# EasyEDA schematic 1-Schematic_OrionPRO-Original.json, sheets 3 to 6 of 6

## Sheets
3 System-BUS: TITLE: OrionPRO - Системная шина; Date: 2021-10-26; Sheet: 3/6
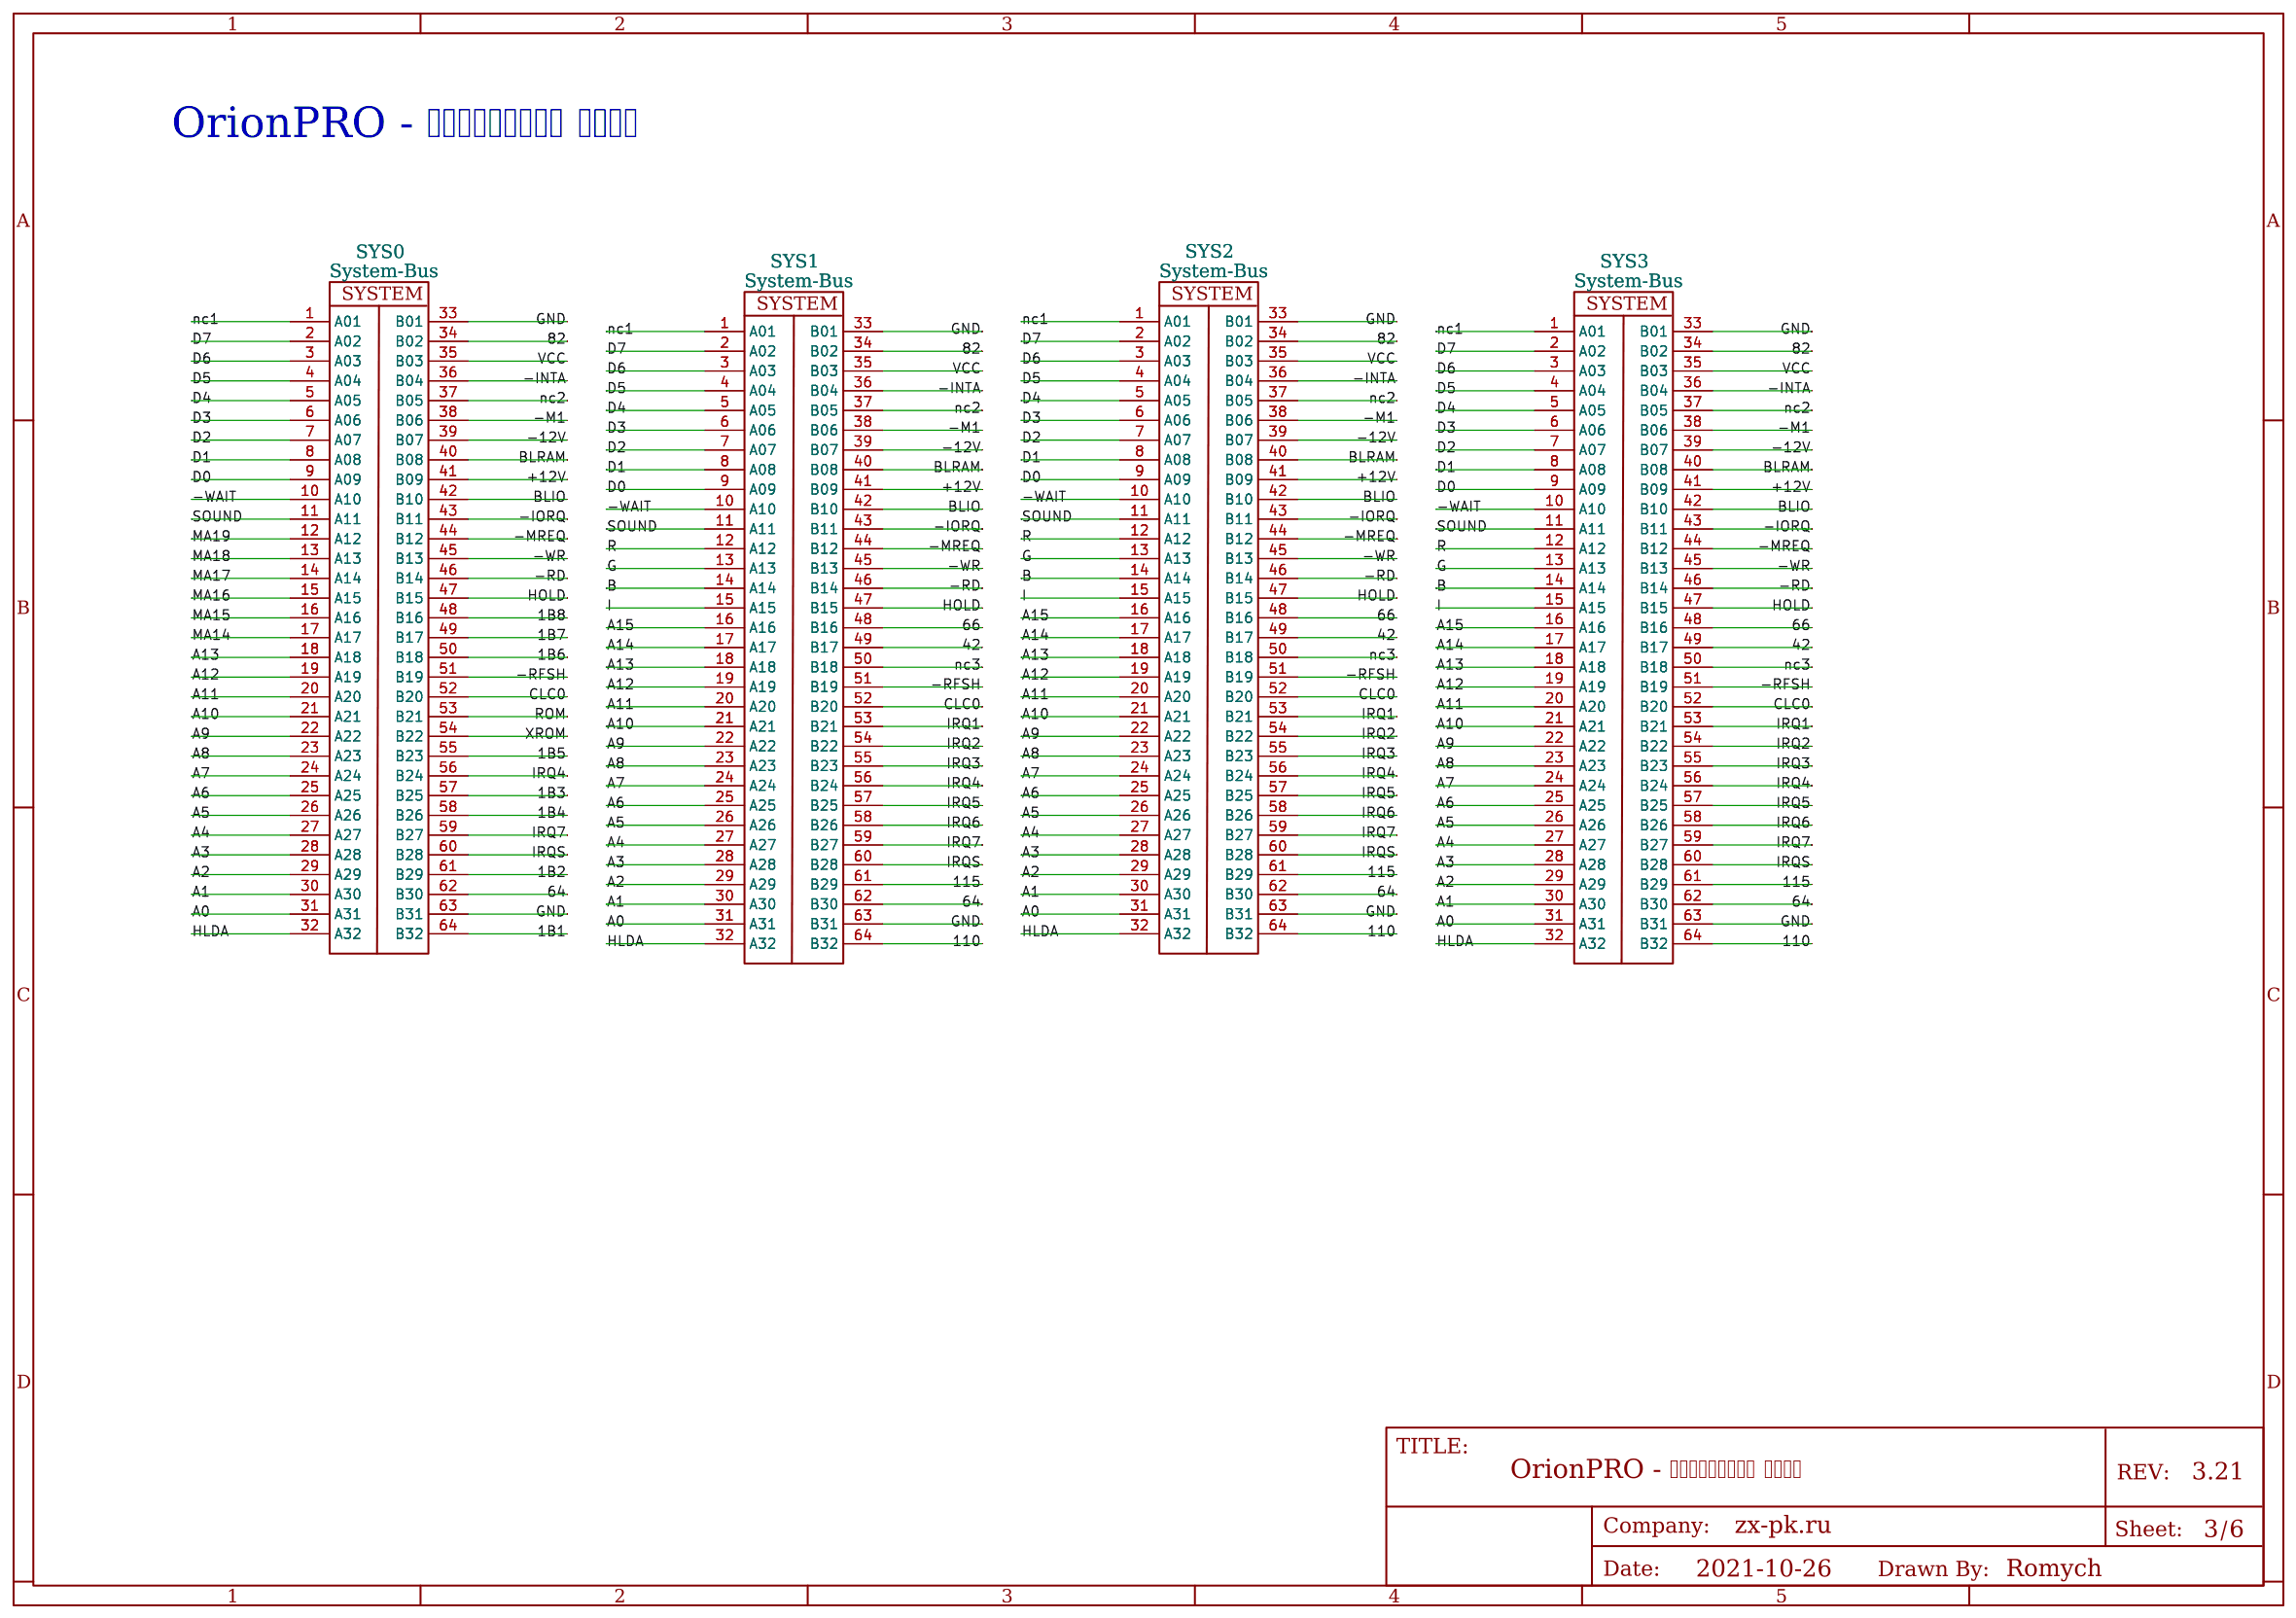
[diagram p2: System-BUS]
4 PowerSource: TITLE: Orion-PRO AT- Питание; Date: 2021-10-31; Sheet: 4/6
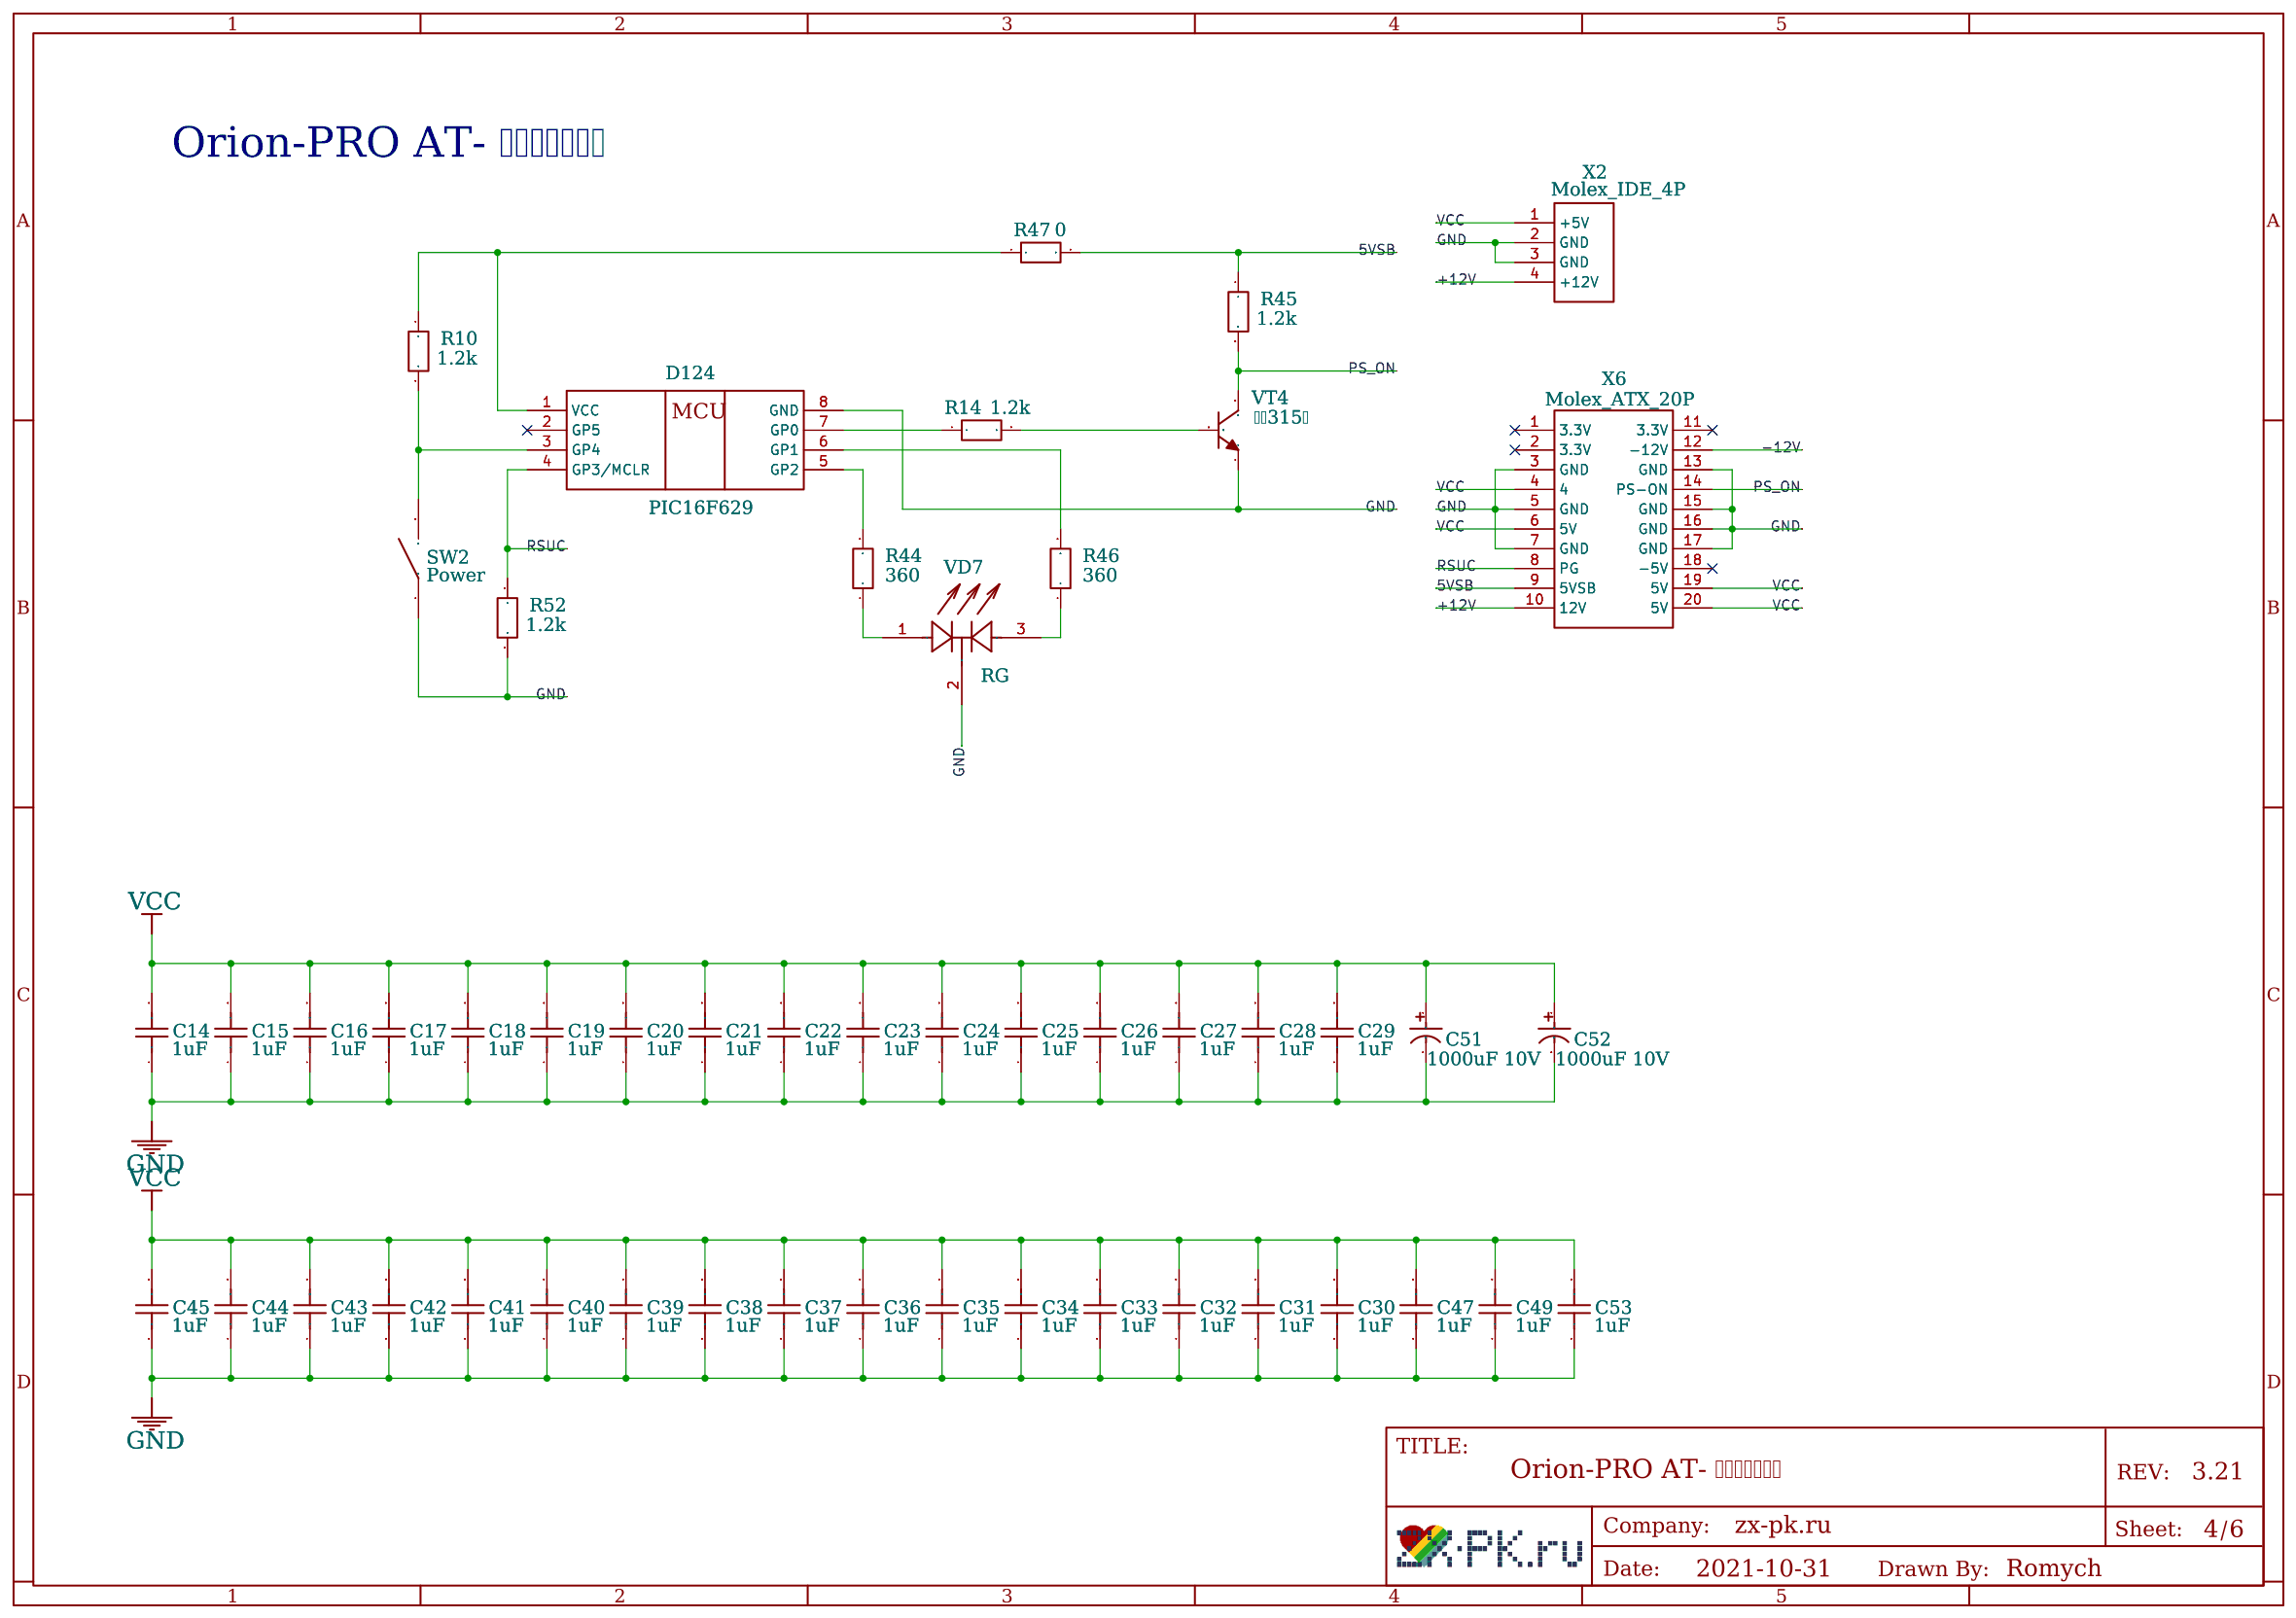
[diagram p3: PowerSource]
5 PS2Controller: TITLE: OrionPRO - Контроллер клавиатуры PS/2; Date: 2021-11-02; Sheet: 5/6
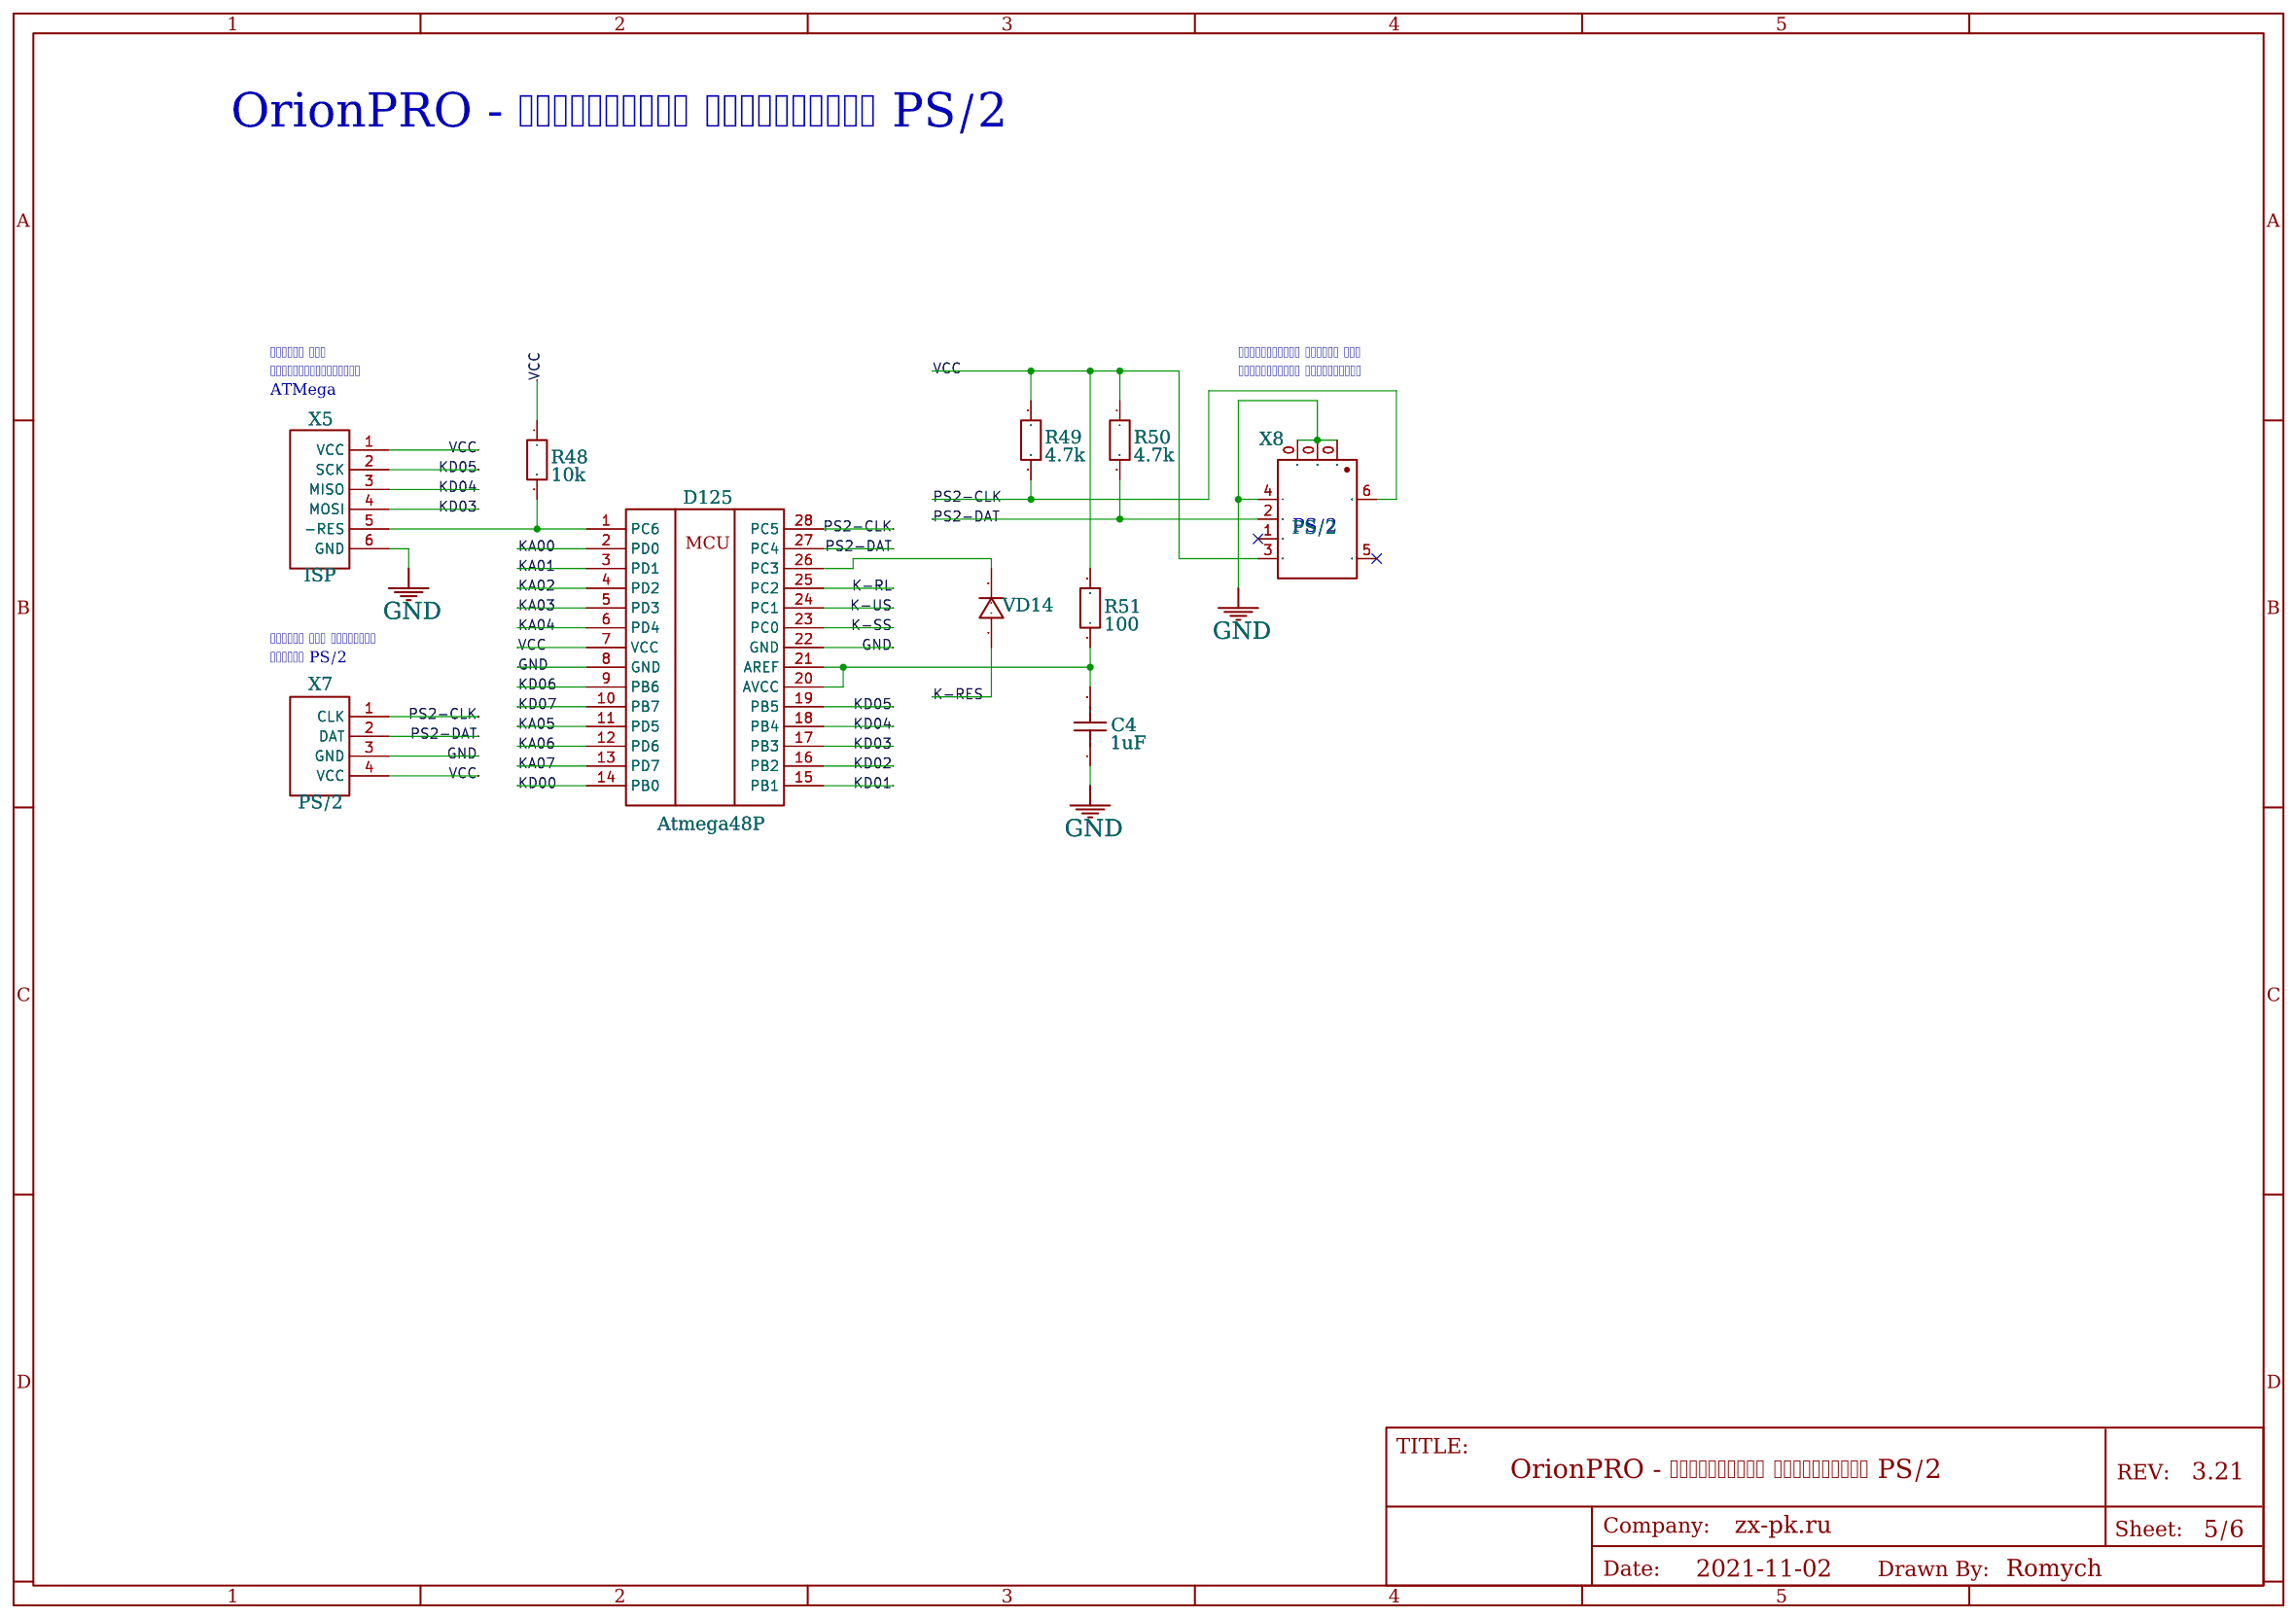
[diagram p4: PS2Controller]
6 Error404: TITLE: OrionPRO - Доработки от error404; Date: 2021-11-06; Sheet: 6/6
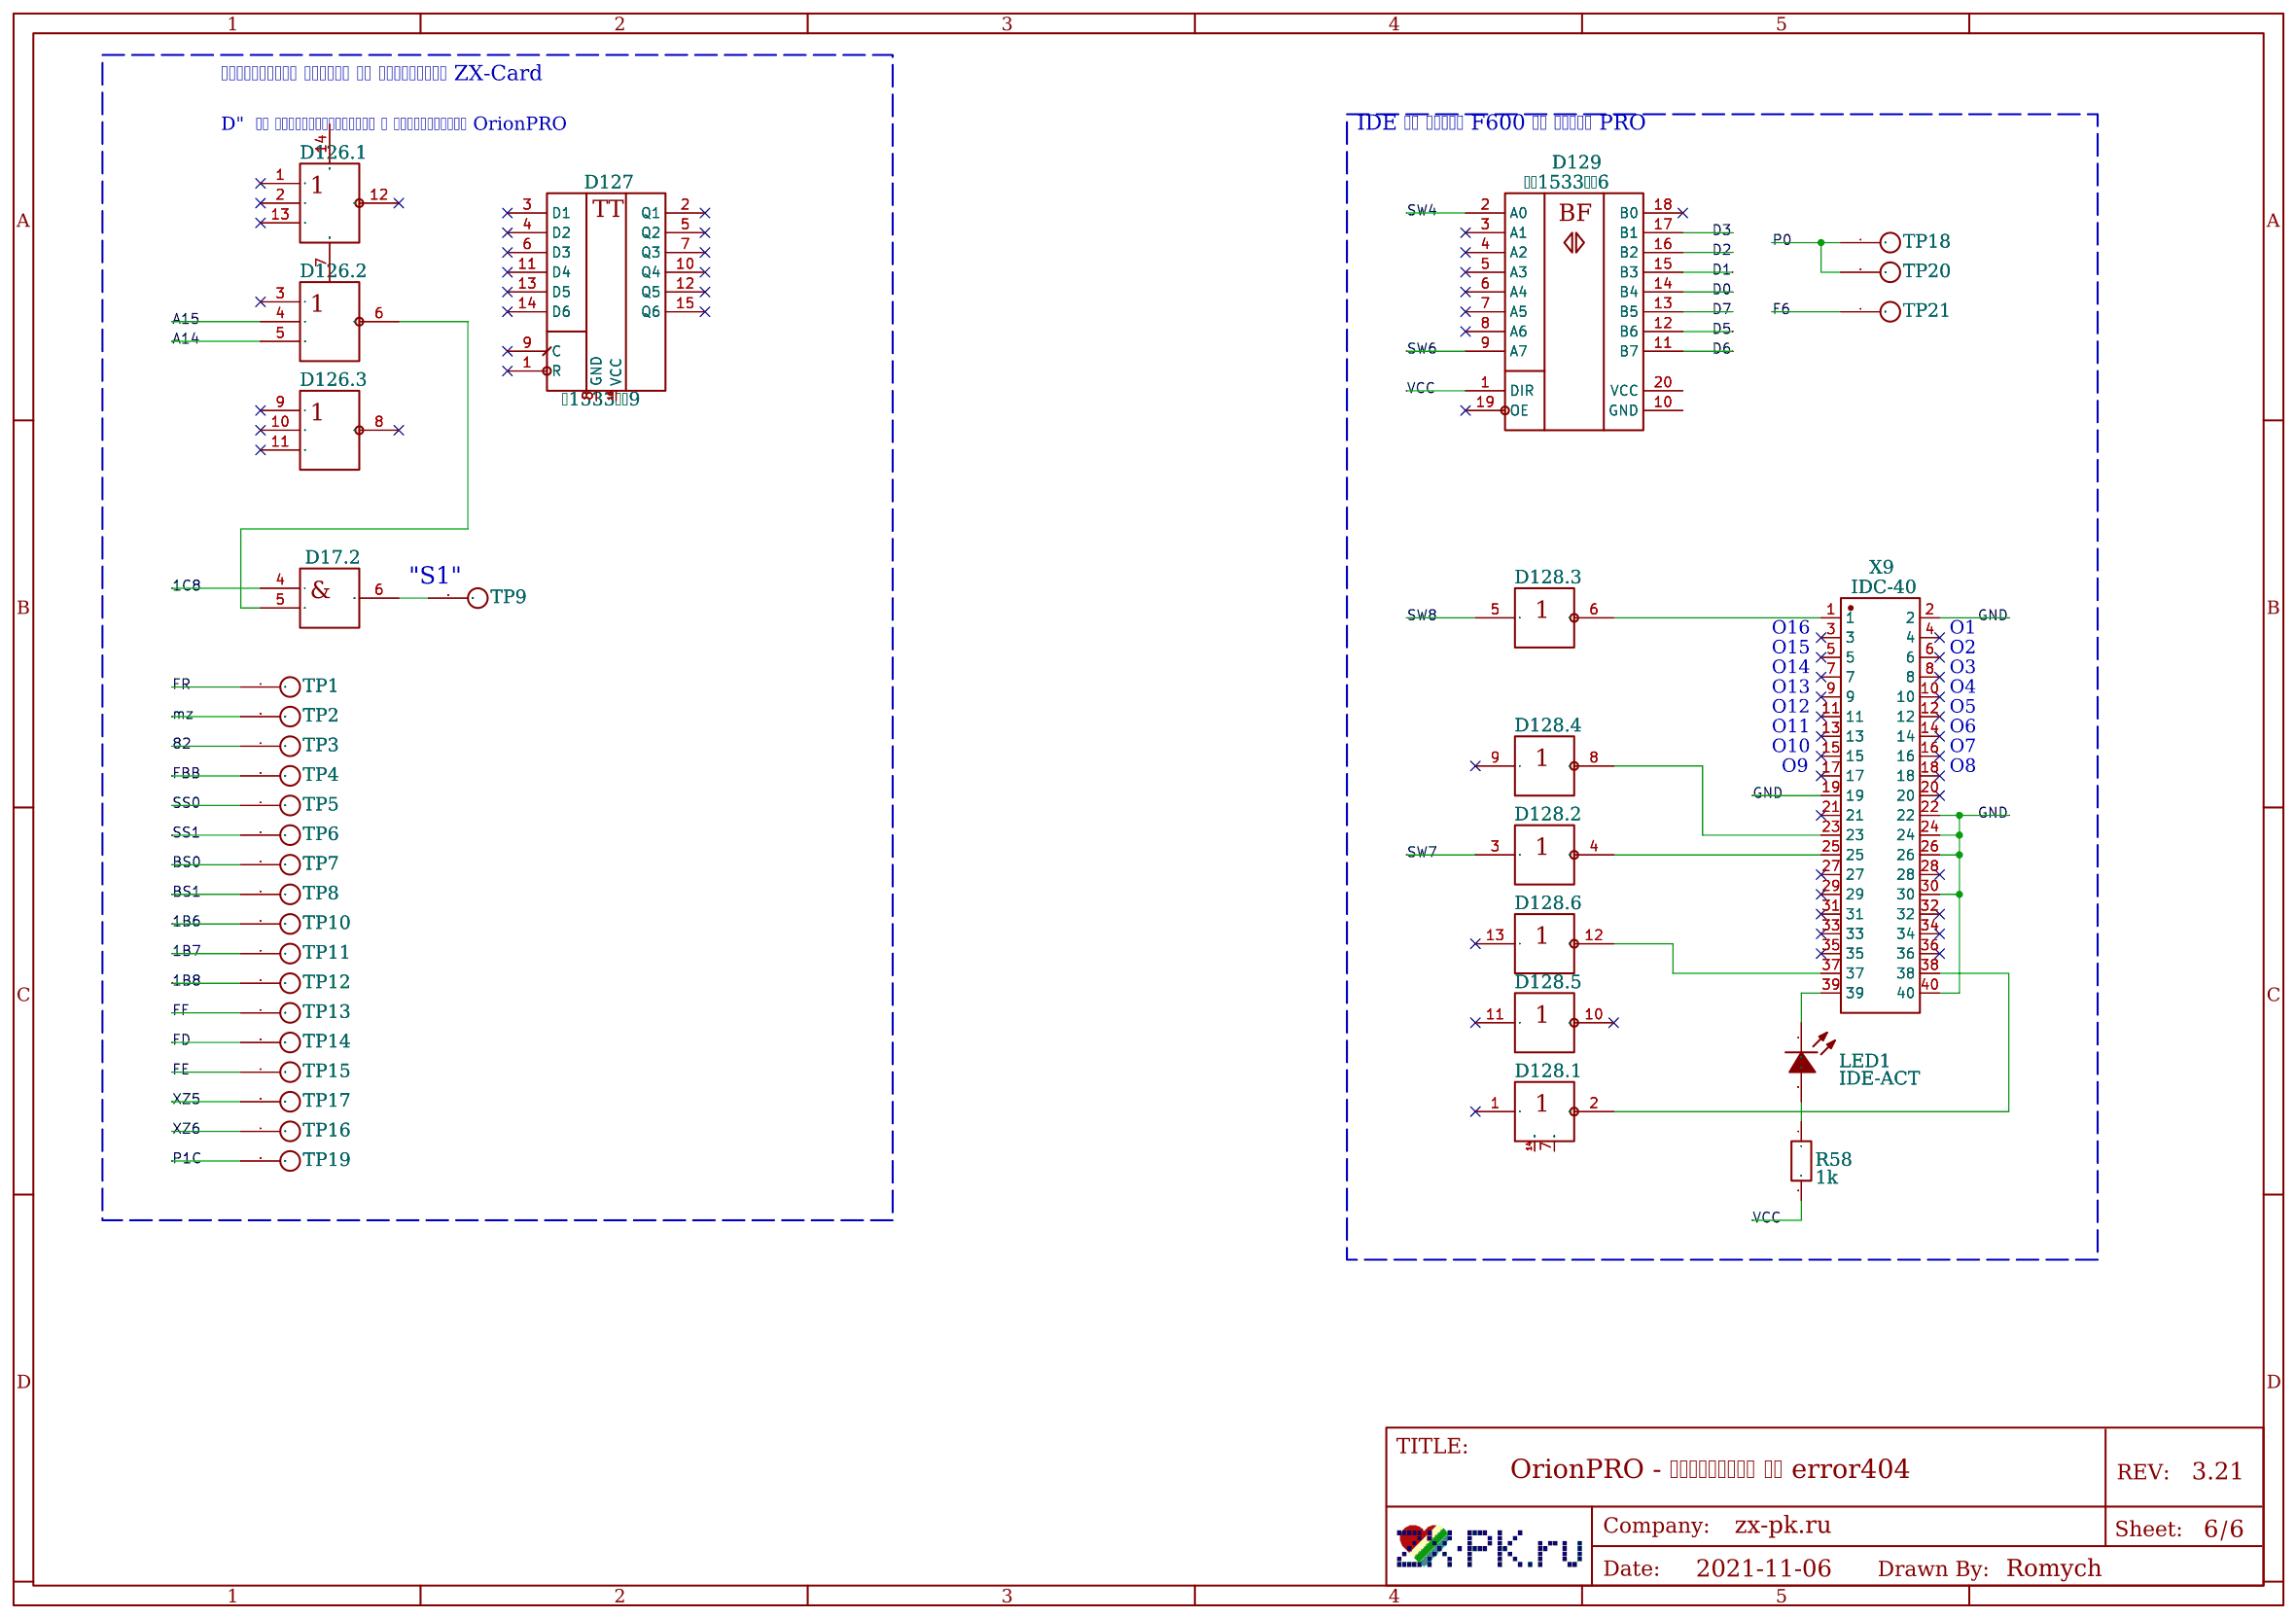
[diagram p5: Error404]

## Parts
sheet Error404
D127  К1533ТМ9  [DIP-16_STD]
D129  КР1533АП6  [DIP-20_STD]
LED1  IDE-ACT  [LED-TH_BD3.0-P2.54-FD]
R58  1k  [R_0.125_V_TH]
TP1  FR  [TH-TEST-1]
TP2  mz  [TH-TEST-1]
TP3  -RES  [TH-TEST-1]
TP4  FB  [SMD-TEST-1-SMALL]
TP5  SS0  [SMD-TEST-1-SMALL]
TP6  SS1  [SMD-TEST-1-SMALL]
TP7  BS0  [SMD-TEST-1-SMALL]
TP8  BS1  [SMD-TEST-1-SMALL]
TP9  S1  [TH-TEST-1]
TP10  1B6  [TH-TEST-1]
TP11  1B7  [TH-TEST-1]
TP12  1B8  [TH-TEST-1]
TP13  ff  [TH-TEST-1]
TP14  fd  [TH-TEST-1]
TP15  fe  [TH-TEST-1]
TP16  xz6  [TH-TEST-1]
TP17  xz5  [TH-TEST-1]
TP18  prn  [TH-TEST-1]
TP19  P1C  [TH-TEST-1]
TP20  P0  [TH-TEST-1]
TP21  F600  [TH-TEST-1]
X9  IDC-40  [CONN-TH_40P-P2.54_MTFD10-40B1]
sheet PowerSource
C14  1uF  [CAP-TH_L7.62]
C15  1uF  [CAP-TH_L7.62]
C16  1uF  [CAP-TH_L7.62]
C17  1uF  [CAP-TH_L7.62]
C18  1uF  [CAP-TH_L7.62]
C19  1uF  [CAP-TH_L7.62]
C20  1uF  [CAP-TH_L7.62]
C21  1uF  [CAP-TH_L7.62]
C22  1uF  [CAP-TH_L7.62]
C23  1uF  [CAP-TH_L7.62]
C24  1uF  [CAP-TH_L7.62]
C25  1uF  [CAP-TH_L7.62]
C26  1uF  [CAP-TH_L7.62]
C27  1uF  [CAP-TH_L7.62]
C28  1uF  [CAP-TH_L7.62]
C29  1uF  [CAP-TH_L7.62]
C30  1uF  [CAP-TH_L7.62]
C31  1uF  [CAP-TH_L7.62]
C32  1uF  [CAP-TH_L7.62]
C33  1uF  [CAP-TH_L7.62]
C34  1uF  [CAP-TH_L7.62]
C35  1uF  [CAP-TH_L7.62]
C36  1uF  [CAP-TH_L7.62]
C37  1uF  [CAP-TH_L7.62]
C38  1uF  [CAP-TH_L7.62]
C39  1uF  [CAP-TH_L7.62]
C40  1uF  [CAP-TH_L7.62]
C41  1uF  [CAP-TH_L7.62]
C42  1uF  [CAP-TH_L7.62]
C43  1uF  [CAP-TH_L7.62]
C44  1uF  [CAP-TH_L7.62]
C45  1uF  [CAP-TH_L5.08]
C47  1uF  [CAP-TH_L7.62]
C49  1uF  [CAP-TH_L7.62]
C51  1000uF 10V  [CAP-TH_L25_P7.62_EL_V]
C52  1000uF 10V  [CAP-TH_L25_P7.62_EL_H]
C53  1uF  [CAP-TH_L7.62]
D124  PIC16F629  [DIP-8_STD]
R10  1.2k  [R_0.125_V_TH]
R14  1.2k  [R_0.125_V_TH]
R44  360  [R_0.125_V_TH]
R45  1.2k  [R_0.125_V_TH]
R46  360  [R_0.125_V_TH]
R47  0  [R_0.125_V_TH]
R52  1.2k  [R_0.125_V_TH]
SW2  Power  [HDR-TH_2P_P2.54_SW]
VD7  RG  [LED_BICOL_AKA_5]
VT4  КТ315Б  [TO-92-3_L4.8-W3.7-P2.54-L]
X2  Molex_IDE_4P  [HDR-TH_4P_5.08_MOLEX]
X6  Molex_ATX_20P  [CONN-TH_20P-P4.20_5566-20A]
sheet PS2Controller
C4  1uF  [CAP-TH_L5.08]
D125  Atmega48P  [DIP-28_L35.0-W6.5-P2.54-LS7.6-BL]
R48  10k  [R_0.125_7.62]
R49  4.7k  [R_0.25_10.16]
R50  4.7k  [R_0.25_10.16]
R51  100  [R_0.125_V_TH]
VD14  1N4148  [D_TH_7.62]
X5  ISP  [HDR-TH_6P-P2.54]
X7  PS/2  [HDR-TH_4P-P2.54]
X8  PS/2  [PS2-TH_6P-P2.05-S2.49_L12.8-W14.0-M]
sheet System-BUS
SYS0  System-Bus  [SYS_CONN_OPRO_32X2_MB]
SYS1  System-Bus  [SYS_CONN_OPRO_32X2_MB]
SYS2  System-Bus  [SYS_CONN_OPRO_32X2_MB]
SYS3  System-Bus  [SYS_CONN_OPRO_32X2_MB]

## Library data of the parts
D127 = К1533ТМ9: Supplier: chipdip; Contributor: Roman Boykov
D129 = КР1533АП6: Supplier: chipdip; Contributor: romychs_4693
LED1 = HL-304H3GD: Supplier: LCSC; Supplier Part: C568935; Manufacturer: HONGLITRONIC(Hongli Zhihui (HONGLITRONIC)); Contributor: LCSC
R10 R14 R44-R52 R58 = RN 1/8W 470R F T/B A1: Supplier: LCSC; Supplier Part: C433478; Manufacturer: TyoHM; Contributor: LCSC
TP1-TP3 TP9-TP21 = TH-TEST-1: Contributor: romychs_4693
TP4-TP8 = SMD-TEST-1-RND: Contributor: Roman Boykov
X9 = MTFD10-40B1: Supplier: LCSC; Supplier Part: C376159; Manufacturer: MINTRON; Contributor: LCSC
C14-C45 C47 C49 C53 = CK45-R3AD152K-VRY: Supplier: LCSC; Supplier Part: C340608; Manufacturer: TDK; Contributor: LCSC; JLCPCB Part Class: Extended Part
C51 C52 = ECLJ0612220M101P00: Supplier: LCSC; Supplier Part: C156809; Manufacturer: Guangdong TOPAZ Elec Tech; Contributor: LCSC
D124 = PIC16F629: Manufacturer: Microchip; Contributor: romychs_4693
SW2 = Switch-2.5mm: Contributor: romychs_4693
VD7 = BiColorLED-AKA: Contributor: Roman Boykov
VT4 = 2SC1815-TA: Supplier: LCSC; Manufacturer: CJ; image: //image.lceda.cn/szlcsc/C41114.jpg; Supplier Part: C41114
X2 = Molex_IDE_4P: Contributor: romychs_4693
X6 = Molex_ATX_20P: Contributor: Roman Boykov
C4 = CK45-R3AD152K-VRY: Supplier: LCSC; Supplier Part: C340608; Manufacturer: TDK; Contributor: LCSC
D125 = Atmega48P: Manufacturer Part: Atmel; Contributor: Roman Boykov
VD14 = 1N4148: Contributor: EasyEDA
X5 = Atmega-ISP-6P: Contributor: romychs_4693
X7 = PinHeader_1x4: Contributor: Roman Boykov
X8 = 5749180-1: Supplier: LCSC; Supplier Part: C305986; Manufacturer: TE Connectivity; Contributor: LCSC
SYS0-SYS3 = SysConnOPro-32MB: Supplier: chipdip; Contributor: Roman Boykov

## Nets
5VSB: R45.1 R47.2 X6.9(5VSB)
+12V: SYS0.41(B09) SYS1.41(B09) SYS2.41(B09) SYS3.41(B09) X2.4(+12V) X6.10(12V) ; also on sheet 1
-12V: SYS0.39(B07) SYS1.39(B07) SYS2.39(B07) SYS3.39(B07) X6.12(-12V)
GND: C4.1 C14.1 C15.1 C16.1 C17.1 C18.1 C19.1 C20.1 C21.1 C22.1 C23.1 C24.1 C25.1 C26.1 C27.1 C28.1 C29.1 C30.1 C31.1 C32.1 C33.1 C34.1 C35.1 C36.1 C37.1 C38.1 C39.1 C40.1 C41.1 C42.1 C43.1 C44.1 C45.1 C47.1 C49.1 C51.2 C52.2 C53.1 D124.8(GND) D125.8(GND) D125.22(GND) R52.2 SW2.1 SYS0.33(B01) SYS0.63(B31) SYS1.33(B01) SYS1.63(B31) SYS2.33(B01) SYS2.63(B31) SYS3.33(B01) SYS3.63(B31) VD7.2 VT4.1(E) X2.2(GND) X2.3(GND) X5.6(GND) X6.3(GND) X6.5(GND) X6.7(GND) X6.13(GND) X6.15(GND) X6.16(GND) X6.17(GND) X7.3(GND) X8.0 X8.4 X9.2 X9.19 X9.22 X9.24 X9.26 X9.30 X9.40 ; also on sheet 1
VCC: C14.2 C15.2 C16.2 C17.2 C18.2 C19.2 C20.2 C21.2 C22.2 C23.2 C24.2 C25.2 C26.2 C27.2 C28.2 C29.2 C30.2 C31.2 C32.2 C33.2 C34.2 C35.2 C36.2 C37.2 C38.2 C39.2 C40.2 C41.2 C42.2 C43.2 C44.2 C45.2 C47.2 C49.2 C51.1 C52.1 C53.2 D125.7(VCC) D129.1(DIR) R48.1 R49.1 R50.1 R51.2 R58.2 SYS0.35(B03) SYS1.35(B03) SYS2.35(B03) SYS3.35(B03) X2.1(+5V) X5.1(VCC) X6.4 X6.6(5V) X6.19(5V) X6.20(5V) X7.4(VCC) X8.3 ; also on sheet 1
1B1: SYS0.64(B32) ; also on sheet 1
1B2: SYS0.61(B29) ; also on sheet 1
1B3: SYS0.57(B25) ; also on sheet 1
1B4: SYS0.58(B26) ; also on sheet 1
1B5: SYS0.55(B23) ; also on sheet 1
1B6: SYS0.50(B18) TP10.1(TP1) ; also on sheet 1
1B7: SYS0.49(B17) TP11.1(TP1) ; also on sheet 1
1B8: SYS0.48(B16) TP12.1(TP1) ; also on sheet 1
42: SYS1.49(B17) SYS2.49(B17) SYS3.49(B17) ; also on sheet 1
64: SYS0.62(B30) SYS1.62(B30) SYS2.62(B30) SYS3.62(B30) ; also on sheet 1
66: SYS1.48(B16) SYS2.48(B16) SYS3.48(B16)
82: SYS0.34(B02) SYS1.34(B02) SYS2.34(B02) SYS3.34(B02) TP3.1(TP1) ; also on sheet 1
110: SYS1.64(B32) SYS2.64(B32) SYS3.64(B32) ; also on sheet 1
115: SYS1.61(B29) SYS2.61(B29) SYS3.61(B29) ; also on sheet 1
-INTA: SYS0.36(B04) SYS1.36(B04) SYS2.36(B04) SYS3.36(B04) ; also on sheet 1
-IORQ: SYS0.43(B11) SYS1.43(B11) SYS2.43(B11) SYS3.43(B11) ; also on sheet 1
-M1: SYS0.38(B06) SYS1.38(B06) SYS2.38(B06) SYS3.38(B06) ; also on sheet 1
-MREQ: SYS0.44(B12) SYS1.44(B12) SYS2.44(B12) SYS3.44(B12) ; also on sheet 1
-RD: SYS0.46(B14) SYS1.46(B14) SYS2.46(B14) SYS3.46(B14) ; also on sheet 1
-RFSH: SYS0.51(B19) SYS1.51(B19) SYS2.51(B19) SYS3.51(B19) ; also on sheet 1
-WAIT: SYS0.10(A10) SYS1.10(A10) SYS2.10(A10) SYS3.10(A10) ; also on sheet 1
-WR: SYS0.45(B13) SYS1.45(B13) SYS2.45(B13) SYS3.45(B13) ; also on sheet 1
A0: SYS0.31(A31) SYS1.31(A31) SYS2.31(A31) SYS3.31(A31) ; also on sheet 1
A1: SYS0.30(A30) SYS1.30(A30) SYS2.30(A30) SYS3.30(A30) ; also on sheet 1
A2: SYS0.29(A29) SYS1.29(A29) SYS2.29(A29) SYS3.29(A29) ; also on sheet 1
A3: SYS0.28(A28) SYS1.28(A28) SYS2.28(A28) SYS3.28(A28) ; also on sheet 1
A4: SYS0.27(A27) SYS1.27(A27) SYS2.27(A27) SYS3.27(A27) ; also on sheet 1
A5: SYS0.26(A26) SYS1.26(A26) SYS2.26(A26) SYS3.26(A26) ; also on sheet 1
A6: SYS0.25(A25) SYS1.25(A25) SYS2.25(A25) SYS3.25(A25) ; also on sheet 1
A7: SYS0.24(A24) SYS1.24(A24) SYS2.24(A24) SYS3.24(A24) ; also on sheet 1
A8: SYS0.23(A23) SYS1.23(A23) SYS2.23(A23) SYS3.23(A23) ; also on sheet 1
A9: SYS0.22(A22) SYS1.22(A22) SYS2.22(A22) SYS3.22(A22) ; also on sheet 1
A10: SYS0.21(A21) SYS1.21(A21) SYS2.21(A21) SYS3.21(A21) ; also on sheet 1
A11: SYS0.20(A20) SYS1.20(A20) SYS2.20(A20) SYS3.20(A20) ; also on sheet 1
A12: SYS0.19(A19) SYS1.19(A19) SYS2.19(A19) SYS3.19(A19) ; also on sheet 1
A13: SYS0.18(A18) SYS1.18(A18) SYS2.18(A18) SYS3.18(A18) ; also on sheet 1
A14: SYS1.17(A17) SYS2.17(A17) SYS3.17(A17) ; also on sheet 1
A15: SYS1.16(A16) SYS2.16(A16) SYS3.16(A16) ; also on sheet 1
B: SYS1.14(A14) SYS2.14(A14) SYS3.14(A14) ; also on sheet 1
BLIO: SYS0.42(B10) SYS1.42(B10) SYS2.42(B10) SYS3.42(B10) ; also on sheet 1
BLRAM: SYS0.40(B08) SYS1.40(B08) SYS2.40(B08) SYS3.40(B08) ; also on sheet 1
BS0: TP7.1(TP1) ; also on sheet 1
BS1: TP8.1(TP1) ; also on sheet 1
CLC0: SYS0.52(B20) SYS1.52(B20) SYS2.52(B20) SYS3.52(B20) ; also on sheet 1
D0: D129.14(B4) SYS0.9(A09) SYS1.9(A09) SYS2.9(A09) SYS3.9(A09) ; also on sheet 1 2
D1: D129.15(B3) SYS0.8(A08) SYS1.8(A08) SYS2.8(A08) SYS3.8(A08) ; also on sheet 1 2
D2: D129.16(B2) SYS0.7(A07) SYS1.7(A07) SYS2.7(A07) SYS3.7(A07) ; also on sheet 1 2
D3: D129.17(B1) SYS0.6(A06) SYS1.6(A06) SYS2.6(A06) SYS3.6(A06) ; also on sheet 1 2
D4: SYS0.5(A05) SYS1.5(A05) SYS2.5(A05) SYS3.5(A05) ; also on sheet 1 2
D5: D129.12(B6) SYS0.4(A04) SYS1.4(A04) SYS2.4(A04) SYS3.4(A04) ; also on sheet 1 2
D6: D129.11(B7) SYS0.3(A03) SYS1.3(A03) SYS2.3(A03) SYS3.3(A03) ; also on sheet 1 2
D7: D129.13(B5) SYS0.2(A02) SYS1.2(A02) SYS2.2(A02) SYS3.2(A02) ; also on sheet 1 2
F6: TP21.1(TP1) ; also on sheet 1
FBB: TP4.1(TP1) ; also on sheet 1
FD: TP14.1(TP1) ; also on sheet 1
FE: TP15.1(TP1) ; also on sheet 1
FF: TP13.1(TP1) ; also on sheet 1
FR: TP1.1(TP1) ; also on sheet 1
G: SYS1.13(A13) SYS2.13(A13) SYS3.13(A13) ; also on sheet 1
HLDA: SYS0.32(A32) SYS1.32(A32) SYS2.32(A32) SYS3.32(A32) ; also on sheet 1
HOLD: SYS0.47(B15) SYS1.47(B15) SYS2.47(B15) SYS3.47(B15) ; also on sheet 1
I: SYS1.15(A15) SYS2.15(A15) SYS3.15(A15) ; also on sheet 1
IRQ1: SYS1.53(B21) SYS2.53(B21) SYS3.53(B21) ; also on sheet 1
IRQ2: SYS1.54(B22) SYS2.54(B22) SYS3.54(B22) ; also on sheet 1
IRQ3: SYS1.55(B23) SYS2.55(B23) SYS3.55(B23) ; also on sheet 1
IRQ4: SYS0.56(B24) SYS1.56(B24) SYS2.56(B24) SYS3.56(B24) ; also on sheet 1
IRQ5: SYS1.57(B25) SYS2.57(B25) SYS3.57(B25) ; also on sheet 1
IRQ6: SYS1.58(B26) SYS2.58(B26) SYS3.58(B26) ; also on sheet 1
IRQ7: SYS0.59(B27) SYS1.59(B27) SYS2.59(B27) SYS3.59(B27) ; also on sheet 1
IRQS: SYS0.60(B28) SYS1.60(B28) SYS2.60(B28) SYS3.60(B28) ; also on sheet 1
K-RES: VD14.1(A) ; also on sheet 1
K-RL: D125.25(PC2) ; also on sheet 1
K-SS: D125.23(PC0) ; also on sheet 1
K-US: D125.24(PC1) ; also on sheet 1
KA00: D125.2(PD0) ; also on sheet 1
KA01: D125.3(PD1) ; also on sheet 1
KA02: D125.4(PD2) ; also on sheet 1
KA03: D125.5(PD3) ; also on sheet 1
KA04: D125.6(PD4) ; also on sheet 1
KA05: D125.11(PD5) ; also on sheet 1
KA06: D125.12(PD6) ; also on sheet 1
KA07: D125.13(PD7) ; also on sheet 1
KD00: D125.14(PB0) ; also on sheet 1
KD01: D125.15(PB1) ; also on sheet 1
KD02: D125.16(PB2) ; also on sheet 1
KD03: D125.17(PB3) X5.4(MOSI) ; also on sheet 1
KD04: D125.18(PB4) X5.3(MISO) ; also on sheet 1
KD05: D125.19(PB5) X5.2(SCK) ; also on sheet 1
KD06: D125.9(PB6) ; also on sheet 1
KD07: D125.10(PB7) ; also on sheet 1
MA14: SYS0.17(A17) ; also on sheet 1
MA15: SYS0.16(A16) ; also on sheet 1
MA16: SYS0.15(A15) ; also on sheet 1
MA17: SYS0.14(A14) ; also on sheet 1
MA18: SYS0.13(A13) ; also on sheet 1
MA19: SYS0.12(A12) ; also on sheet 1
mz: TP2.1(TP1) ; also on sheet 1
nc1: SYS0.1(A01) SYS1.1(A01) SYS2.1(A01) SYS3.1(A01)
nc2: SYS0.37(B05) SYS1.37(B05) SYS2.37(B05) SYS3.37(B05)
nc3: SYS1.50(B18) SYS2.50(B18) SYS3.50(B18)
P0: TP18.1(TP1) TP20.1(TP1) ; also on sheet 1
P1C: TP19.1(TP1) ; also on sheet 1
PS2-CLK: D125.28(PC5) R49.2 X7.1(CLK) X8.6
PS2-DAT: D125.27(PC4) R50.2 X7.2(DAT) X8.2
PS_ON: R45.2 VT4.2(C) X6.14(PS-ON)
R: SYS1.12(A12) SYS2.12(A12) SYS3.12(A12) ; also on sheet 1
ROM: SYS0.53(B21) ; also on sheet 1
RSUC: D124.4(GP3/MCLR) R52.1 X6.8(PG) ; also on sheet 1
SOUND: SYS0.11(A11) SYS1.11(A11) SYS2.11(A11) SYS3.11(A11) ; also on sheet 1
SS0: TP5.1(TP1) ; also on sheet 1
SS1: TP6.1(TP1) ; also on sheet 1
SW4: D129.2(A0) ; also on sheet 1
SW6: D129.9(A7) ; also on sheet 1
XROM: SYS0.54(B22) ; also on sheet 1
XZ5: TP17.1(TP1) ; also on sheet 1
XZ6: TP16.1(TP1) ; also on sheet 1
Net-(C4-2): C4.2 D125.20(AVCC) D125.21(AREF) R51.1
Net-(D17.2-6): TP9.1(TP1) ; also on sheet 1
Net-(D124-1): D124.1(VCC) R10.1 R47.1
Net-(D124-3): D124.3(GP4) R10.2 SW2.2
Net-(D124-5): D124.5(GP2) R44.2
Net-(D124-6): D124.6(GP1) R46.2
Net-(D124-7): D124.7(GP0) R14.1
Net-(D125-1): D125.1(PC6) R48.2 X5.5(-RES)
Net-(D125-26): D125.26(PC3) VD14.2(K)
Net-(D128.1-2): X9.38 ; also on sheet 1
Net-(D128.2-4): X9.25 ; also on sheet 1
Net-(D128.3-6): X9.1 ; also on sheet 1
Net-(D128.4-8): X9.23 ; also on sheet 1
Net-(D128.6-12): X9.37 ; also on sheet 1
Net-(LED1-1): LED1.1(C) X9.39
Net-(LED1-2): LED1.2(A) R58.1
Net-(R14-2): R14.2 VT4.3(B)
Net-(R44-1): R44.1 VD7.1
Net-(R46-1): R46.1 VD7.3

Not connected (* = marked no-connect by the designer): D124 2(GP5)*; D127 1(R)* 2(Q1)* 3(D1)* 4(D2)* 5(Q2)* 6(D3)* 7(Q3)* 8(GND) 9(C)* 10(Q4)* 11(D4)* 12(Q5)* 13(D5)* 14(D6)* 15(Q6)* 16(VCC); D129 3(A1)* 4(A2)* 5(A3)* 6(A4)* 7(A5)* 8(A6)* 10(GND) 18(B0)* 19(OE)* 20(VCC); X6 1(3.3V)* 2(3.3V)* 11(3.3V)* 18(-5V)*; X8 1* 5*; X9 3* 4* 5* 6* 7* 8* 9* 10* 11* 12* 13* 14* 15* 16* 17* 18* 20* 21* 27* 28* 29* 31* 32* 33* 34* 35* 36*

## Notes on the sheets
sheet 3
- OrionPRO - Системная шина
sheet 4
- Orion-PRO AT- Питание
sheet 5
- OrionPRO - Контроллер клавиатуры PS/2
- Разъем для
  программирования
  ATMega
- Стандартный разъем для
  подключения клавиатуры
- PS/2
- Разъем для подпайки
  шлейфа PS/2
sheet 6
- Расшитение памяти по стандарту ZX-Card
- IDE На порту F600 на плате PRO
- D"  Не устанавливаются в стандартном OrionPRO
- "S1"
- O16
- O1
- O15
- O2
- O14
- O3
- O12
- O13
- O4
- O5
- O11
- O6
- O10
- O7
- O9
- O8
